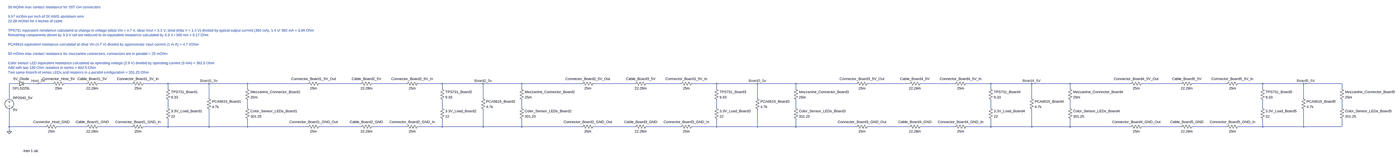
[diagram p0: schematic sensor_system_8_pins.asc, whole sheet]
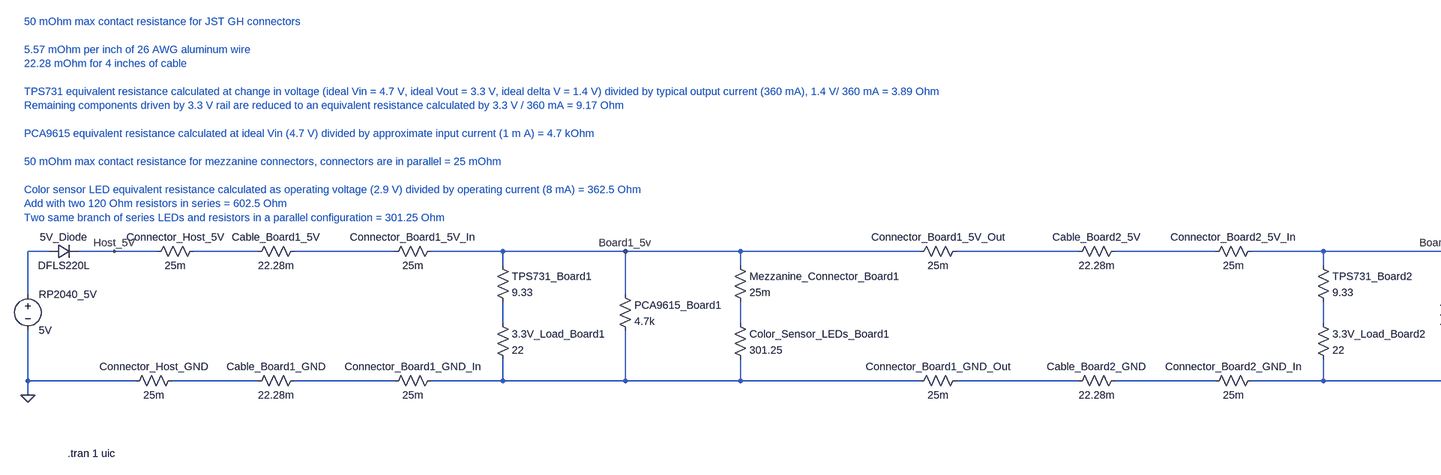
[diagram p1: schematic sensor_system_8_pins.asc, part, row 1 of 1, column 1 of 3]
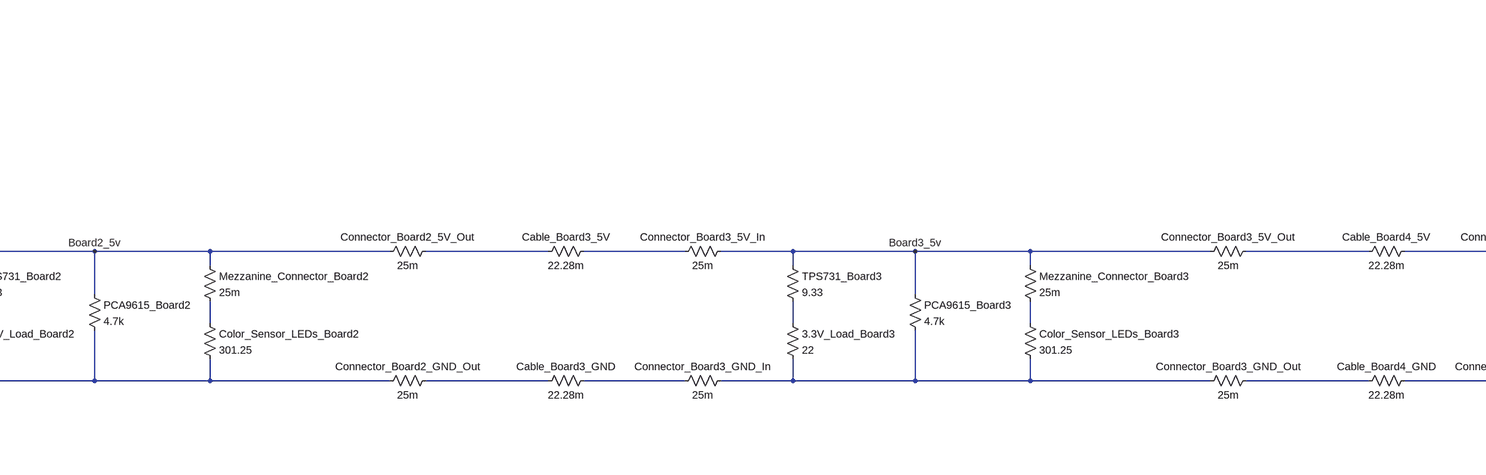
[diagram p2: schematic sensor_system_8_pins.asc, part, row 1 of 1, column 2 of 3]
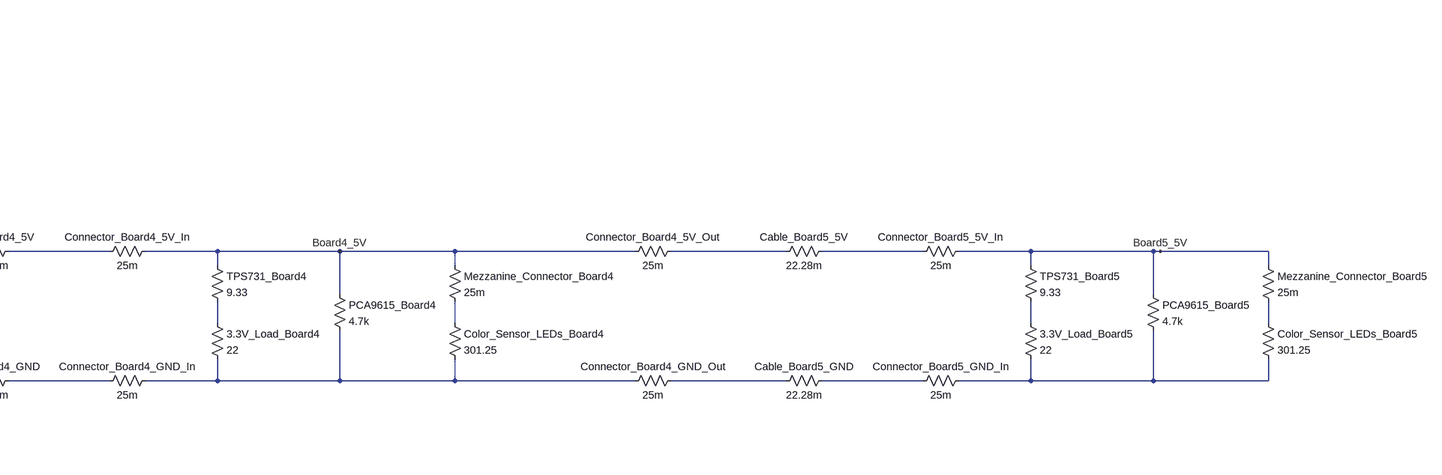
[diagram p3: schematic sensor_system_8_pins.asc, part, row 1 of 1, column 3 of 3]
sensor_system_8_pins.asc, the LTspice schematic file:
Version 4.1
SHEET 1 9256 680
WIRE 64 80 16 80
WIRE 208 80 128 80
WIRE 304 80 208 80
WIRE 528 80 384 80
WIRE 832 80 608 80
WIRE 1072 80 912 80
WIRE 1344 80 1072 80
WIRE 1600 80 1344 80
WIRE 2000 80 1600 80
WIRE 2352 80 2080 80
WIRE 2656 80 2432 80
WIRE 2896 80 2736 80
WIRE 3168 80 2896 80
WIRE 3424 80 3168 80
WIRE 3824 80 3424 80
WIRE 4176 80 3904 80
WIRE 4480 80 4256 80
WIRE 4720 80 4560 80
WIRE 4992 80 4720 80
WIRE 5248 80 4992 80
WIRE 5648 80 5248 80
WIRE 6000 80 5728 80
WIRE 6304 80 6080 80
WIRE 6544 80 6384 80
WIRE 6816 80 6544 80
WIRE 7072 80 6816 80
WIRE 7472 80 7072 80
WIRE 7808 80 7552 80
WIRE 8112 80 7888 80
WIRE 8352 80 8192 80
WIRE 8624 80 8352 80
WIRE 8640 80 8624 80
WIRE 8880 80 8640 80
WIRE 1072 112 1072 80
WIRE 1600 112 1600 80
WIRE 2896 112 2896 80
WIRE 3424 112 3424 80
WIRE 4720 112 4720 80
WIRE 5248 112 5248 80
WIRE 6544 112 6544 80
WIRE 7072 112 7072 80
WIRE 8352 112 8352 80
WIRE 8880 112 8880 80
WIRE 16 176 16 80
WIRE 1344 176 1344 80
WIRE 3168 176 3168 80
WIRE 4992 176 4992 80
WIRE 6816 176 6816 80
WIRE 8624 176 8624 80
WIRE 1072 240 1072 192
WIRE 1600 240 1600 192
WIRE 2896 240 2896 192
WIRE 3424 240 3424 192
WIRE 4720 240 4720 192
WIRE 5248 240 5248 192
WIRE 6544 240 6544 192
WIRE 7072 240 7072 192
WIRE 8352 240 8352 192
WIRE 8880 240 8880 192
WIRE 16 368 16 256
WIRE 256 368 16 368
WIRE 528 368 336 368
WIRE 832 368 608 368
WIRE 1072 368 1072 320
WIRE 1072 368 912 368
WIRE 1344 368 1344 256
WIRE 1344 368 1072 368
WIRE 1600 368 1600 320
WIRE 1600 368 1344 368
WIRE 2000 368 1600 368
WIRE 2352 368 2080 368
WIRE 2656 368 2432 368
WIRE 2896 368 2896 320
WIRE 2896 368 2736 368
WIRE 3168 368 3168 256
WIRE 3168 368 2896 368
WIRE 3424 368 3424 320
WIRE 3424 368 3168 368
WIRE 3824 368 3424 368
WIRE 4176 368 3904 368
WIRE 4480 368 4256 368
WIRE 4720 368 4720 320
WIRE 4720 368 4560 368
WIRE 4992 368 4992 256
WIRE 4992 368 4720 368
WIRE 5248 368 5248 320
WIRE 5248 368 4992 368
WIRE 5648 368 5248 368
WIRE 6000 368 5728 368
WIRE 6304 368 6080 368
WIRE 6544 368 6544 320
WIRE 6544 368 6384 368
WIRE 6816 368 6816 256
WIRE 6816 368 6544 368
WIRE 7072 368 7072 320
WIRE 7072 368 6816 368
WIRE 7472 368 7072 368
WIRE 7808 368 7552 368
WIRE 8112 368 7888 368
WIRE 8352 368 8352 320
WIRE 8352 368 8192 368
WIRE 8624 368 8624 256
WIRE 8624 368 8352 368
WIRE 8880 368 8880 320
WIRE 8880 368 8624 368
WIRE 16 400 16 368
FLAG 16 400 0
FLAG 8640 80 Board5_5V
FLAG 208 80 Host_5V
FLAG 1344 80 Board1_5v
FLAG 3168 80 Board2_5v
FLAG 4992 80 Board3_5v
FLAG 6816 80 Board4_5V
SYMBOL voltage 16 160 R0
SYMATTR InstName RP2040_5V
SYMATTR Value 5V
SYMBOL diode 64 96 R270
WINDOW 0 32 32 VTop 2
WINDOW 3 0 32 VBottom 2
SYMATTR InstName 5V_Diode
SYMATTR Value DFLS220L
SYMBOL res 400 64 R90
WINDOW 0 0 56 VBottom 2
WINDOW 3 32 56 VTop 2
SYMATTR InstName Connector_Host_5V
SYMATTR Value 25m
SYMBOL res 624 64 R90
WINDOW 0 0 56 VBottom 2
WINDOW 3 32 56 VTop 2
SYMATTR InstName Cable_Board1_5V
SYMATTR Value 22.28m
SYMBOL res 928 64 R90
WINDOW 0 0 56 VBottom 2
WINDOW 3 32 56 VTop 2
SYMATTR InstName Connector_Board1_5V_In
SYMATTR Value 25m
SYMBOL res 1056 96 R0
SYMATTR InstName TPS731_Board1
SYMATTR Value 9.33
SYMBOL res 1328 160 R0
SYMATTR InstName PCA9615_Board1
SYMATTR Value 4.7k
SYMBOL res 1584 96 R0
SYMATTR InstName Mezzanine_Connector_Board1
SYMATTR Value 25m
SYMBOL res 2096 64 R90
WINDOW 0 0 56 VBottom 2
WINDOW 3 32 56 VTop 2
SYMATTR InstName Connector_Board1_5V_Out
SYMATTR Value 25m
SYMBOL res 1584 224 R0
SYMATTR InstName Color_Sensor_LEDs_Board1
SYMATTR Value 301.25
SYMBOL res 624 352 R90
WINDOW 0 0 56 VBottom 2
WINDOW 3 32 56 VTop 2
SYMATTR InstName Cable_Board1_GND
SYMATTR Value 22.28m
SYMBOL res 928 352 R90
WINDOW 0 0 56 VBottom 2
WINDOW 3 32 56 VTop 2
SYMATTR InstName Connector_Board1_GND_In
SYMATTR Value 25m
SYMBOL res 2096 352 R90
WINDOW 0 0 56 VBottom 2
WINDOW 3 32 56 VTop 2
SYMATTR InstName Connector_Board1_GND_Out
SYMATTR Value 25m
SYMBOL res 1056 224 R0
SYMATTR InstName 3.3V_Load_Board1
SYMATTR Value 22
SYMBOL res 2448 64 R90
WINDOW 0 0 56 VBottom 2
WINDOW 3 32 56 VTop 2
SYMATTR InstName Cable_Board2_5V
SYMATTR Value 22.28m
SYMBOL res 2752 64 R90
WINDOW 0 0 56 VBottom 2
WINDOW 3 32 56 VTop 2
SYMATTR InstName Connector_Board2_5V_In
SYMATTR Value 25m
SYMBOL res 2880 96 R0
SYMATTR InstName TPS731_Board2
SYMATTR Value 9.33
SYMBOL res 3152 160 R0
SYMATTR InstName PCA9615_Board2
SYMATTR Value 4.7k
SYMBOL res 3408 96 R0
SYMATTR InstName Mezzanine_Connector_Board2
SYMATTR Value 25m
SYMBOL res 3920 64 R90
WINDOW 0 0 56 VBottom 2
WINDOW 3 32 56 VTop 2
SYMATTR InstName Connector_Board2_5V_Out
SYMATTR Value 25m
SYMBOL res 3408 224 R0
SYMATTR InstName Color_Sensor_LEDs_Board2
SYMATTR Value 301.25
SYMBOL res 2448 352 R90
WINDOW 0 0 56 VBottom 2
WINDOW 3 32 56 VTop 2
SYMATTR InstName Cable_Board2_GND
SYMATTR Value 22.28m
SYMBOL res 2752 352 R90
WINDOW 0 0 56 VBottom 2
WINDOW 3 32 56 VTop 2
SYMATTR InstName Connector_Board2_GND_In
SYMATTR Value 25m
SYMBOL res 3920 352 R90
WINDOW 0 0 56 VBottom 2
WINDOW 3 32 56 VTop 2
SYMATTR InstName Connector_Board2_GND_Out
SYMATTR Value 25m
SYMBOL res 2880 224 R0
SYMATTR InstName 3.3V_Load_Board2
SYMATTR Value 22
SYMBOL res 4272 64 R90
WINDOW 0 0 56 VBottom 2
WINDOW 3 32 56 VTop 2
SYMATTR InstName Cable_Board3_5V
SYMATTR Value 22.28m
SYMBOL res 4576 64 R90
WINDOW 0 0 56 VBottom 2
WINDOW 3 32 56 VTop 2
SYMATTR InstName Connector_Board3_5V_In
SYMATTR Value 25m
SYMBOL res 4704 96 R0
SYMATTR InstName TPS731_Board3
SYMATTR Value 9.33
SYMBOL res 4976 160 R0
SYMATTR InstName PCA9615_Board3
SYMATTR Value 4.7k
SYMBOL res 5232 96 R0
SYMATTR InstName Mezzanine_Connector_Board3
SYMATTR Value 25m
SYMBOL res 5744 64 R90
WINDOW 0 0 56 VBottom 2
WINDOW 3 32 56 VTop 2
SYMATTR InstName Connector_Board3_5V_Out
SYMATTR Value 25m
SYMBOL res 5232 224 R0
SYMATTR InstName Color_Sensor_LEDs_Board3
SYMATTR Value 301.25
SYMBOL res 4272 352 R90
WINDOW 0 0 56 VBottom 2
WINDOW 3 32 56 VTop 2
SYMATTR InstName Cable_Board3_GND
SYMATTR Value 22.28m
SYMBOL res 4576 352 R90
WINDOW 0 0 56 VBottom 2
WINDOW 3 32 56 VTop 2
SYMATTR InstName Connector_Board3_GND_In
SYMATTR Value 25m
SYMBOL res 5744 352 R90
WINDOW 0 0 56 VBottom 2
WINDOW 3 32 56 VTop 2
SYMATTR InstName Connector_Board3_GND_Out
SYMATTR Value 25m
SYMBOL res 4704 224 R0
SYMATTR InstName 3.3V_Load_Board3
SYMATTR Value 22
SYMBOL res 6096 64 R90
WINDOW 0 0 56 VBottom 2
WINDOW 3 32 56 VTop 2
SYMATTR InstName Cable_Board4_5V
SYMATTR Value 22.28m
SYMBOL res 6400 64 R90
WINDOW 0 0 56 VBottom 2
WINDOW 3 32 56 VTop 2
SYMATTR InstName Connector_Board4_5V_In
SYMATTR Value 25m
SYMBOL res 6528 96 R0
SYMATTR InstName TPS731_Board4
SYMATTR Value 9.33
SYMBOL res 6800 160 R0
SYMATTR InstName PCA9615_Board4
SYMATTR Value 4.7k
SYMBOL res 7056 96 R0
SYMATTR InstName Mezzanine_Connector_Board4
SYMATTR Value 25m
SYMBOL res 7568 64 R90
WINDOW 0 0 56 VBottom 2
WINDOW 3 32 56 VTop 2
SYMATTR InstName Connector_Board4_5V_Out
SYMATTR Value 25m
SYMBOL res 7056 224 R0
SYMATTR InstName Color_Sensor_LEDs_Board4
SYMATTR Value 301.25
SYMBOL res 6096 352 R90
WINDOW 0 0 56 VBottom 2
WINDOW 3 32 56 VTop 2
SYMATTR InstName Cable_Board4_GND
SYMATTR Value 22.28m
SYMBOL res 6400 352 R90
WINDOW 0 0 56 VBottom 2
WINDOW 3 32 56 VTop 2
SYMATTR InstName Connector_Board4_GND_In
SYMATTR Value 25m
SYMBOL res 7568 352 R90
WINDOW 0 0 56 VBottom 2
WINDOW 3 32 56 VTop 2
SYMATTR InstName Connector_Board4_GND_Out
SYMATTR Value 25m
SYMBOL res 6528 224 R0
SYMATTR InstName 3.3V_Load_Board4
SYMATTR Value 22
SYMBOL res 7904 64 R90
WINDOW 0 0 56 VBottom 2
WINDOW 3 32 56 VTop 2
SYMATTR InstName Cable_Board5_5V
SYMATTR Value 22.28m
SYMBOL res 8208 64 R90
WINDOW 0 0 56 VBottom 2
WINDOW 3 32 56 VTop 2
SYMATTR InstName Connector_Board5_5V_In
SYMATTR Value 25m
SYMBOL res 8336 96 R0
SYMATTR InstName TPS731_Board5
SYMATTR Value 9.33
SYMBOL res 8608 160 R0
SYMATTR InstName PCA9615_Board5
SYMATTR Value 4.7k
SYMBOL res 8864 96 R0
SYMATTR InstName Mezzanine_Connector_Board5
SYMATTR Value 25m
SYMBOL res 8864 224 R0
SYMATTR InstName Color_Sensor_LEDs_Board5
SYMATTR Value 301.25
SYMBOL res 7904 352 R90
WINDOW 0 0 56 VBottom 2
WINDOW 3 32 56 VTop 2
SYMATTR InstName Cable_Board5_GND
SYMATTR Value 22.28m
SYMBOL res 8208 352 R90
WINDOW 0 0 56 VBottom 2
WINDOW 3 32 56 VTop 2
SYMATTR InstName Connector_Board5_GND_In
SYMATTR Value 25m
SYMBOL res 8336 224 R0
SYMATTR InstName 3.3V_Load_Board5
SYMATTR Value 22
SYMBOL res 352 352 R90
WINDOW 0 0 56 VBottom 2
WINDOW 3 32 56 VTop 2
SYMATTR InstName Connector_Host_GND
SYMATTR Value 25m
TEXT 8 -432 Left 2 ;50 mOhm max contact resistance for JST GH connectors\n \n5.57 mOhm per inch of 26 AWG aluminum wire\n22.28 mOhm for 4 inches of cable\n \nTPS731 equivalent resistance calculated at change in voltage (ideal Vin = 4.7 V, ideal Vout = 3.3 V, ideal delta V = 1.4 V) divided by typical output current (360 mA), 1.4 V/ 360 mA = 3.89 Ohm\nRemaining components driven by 3.3 V rail are reduced to an equivalent resistance calculated by 3.3 V / 360 mA = 9.17 Ohm\n \nPCA9615 equivalent resistance calculated at ideal Vin (4.7 V) divided by approximate input current (1 m A) = 4.7 kOhm\n \n50 mOhm max contact resistance for mezzanine connectors, connectors are in parallel = 25 mOhm\n \nColor sensor LED equivalent resistance calculated as operating voltage (2.9 V) divided by operating current (8 mA) = 362.5 Ohm\nAdd with two 120 Ohm resistors in series = 602.5 Ohm\nTwo same branch of series LEDs and resistors in a parallel configuration = 301.25 Ohm
TEXT 104 552 Left 2 !.tran 1 uic

The netlist it stands for:
* sensor_system_8_pins.asc
V§RP2040_5V N001 0 5V
D§5V_Diode N001 Host_5V DFLS220L
R§Connector_Host_5V N002 Host_5V 25m
R§Cable_Board1_5V N003 N002 22.28m
R§Connector_Board1_5V_In Board1_5v N003 25m
R§TPS731_Board1 Board1_5v N012 9.33
R§PCA9615_Board1 Board1_5v N024 4.7k
R§Mezzanine_Connector_Board1 Board1_5v N013 25m
R§Connector_Board1_5V_Out N004 Board1_5v 25m
R§Color_Sensor_LEDs_Board1 N013 N024 301.25
R§Cable_Board1_GND N023 N022 22.28m
R§Connector_Board1_GND_In N024 N023 25m
R§Connector_Board1_GND_Out N025 N024 25m
R§3.3V_Load_Board1 N012 N024 22
R§Cable_Board2_5V N005 N004 22.28m
R§Connector_Board2_5V_In Board2_5v N005 25m
R§TPS731_Board2 Board2_5v N014 9.33
R§PCA9615_Board2 Board2_5v N027 4.7k
R§Mezzanine_Connector_Board2 Board2_5v N015 25m
R§Connector_Board2_5V_Out N006 Board2_5v 25m
R§Color_Sensor_LEDs_Board2 N015 N027 301.25
R§Cable_Board2_GND N026 N025 22.28m
R§Connector_Board2_GND_In N027 N026 25m
R§Connector_Board2_GND_Out N028 N027 25m
R§3.3V_Load_Board2 N014 N027 22
R§Cable_Board3_5V N007 N006 22.28m
R§Connector_Board3_5V_In Board3_5v N007 25m
R§TPS731_Board3 Board3_5v N016 9.33
R§PCA9615_Board3 Board3_5v N030 4.7k
R§Mezzanine_Connector_Board3 Board3_5v N017 25m
R§Connector_Board3_5V_Out N008 Board3_5v 25m
R§Color_Sensor_LEDs_Board3 N017 N030 301.25
R§Cable_Board3_GND N029 N028 22.28m
R§Connector_Board3_GND_In N030 N029 25m
R§Connector_Board3_GND_Out N031 N030 25m
R§3.3V_Load_Board3 N016 N030 22
R§Cable_Board4_5V N009 N008 22.28m
R§Connector_Board4_5V_In Board4_5V N009 25m
R§TPS731_Board4 Board4_5V N018 9.33
R§PCA9615_Board4 Board4_5V N033 4.7k
R§Mezzanine_Connector_Board4 Board4_5V N019 25m
R§Connector_Board4_5V_Out N010 Board4_5V 25m
R§Color_Sensor_LEDs_Board4 N019 N033 301.25
R§Cable_Board4_GND N032 N031 22.28m
R§Connector_Board4_GND_In N033 N032 25m
R§Connector_Board4_GND_Out N034 N033 25m
R§3.3V_Load_Board4 N018 N033 22
R§Cable_Board5_5V N011 N010 22.28m
R§Connector_Board5_5V_In Board5_5V N011 25m
R§TPS731_Board5 Board5_5V N020 9.33
R§PCA9615_Board5 Board5_5V N036 4.7k
R§Mezzanine_Connector_Board5 Board5_5V N021 25m
R§Color_Sensor_LEDs_Board5 N021 N036 301.25
R§Cable_Board5_GND N035 N034 22.28m
R§Connector_Board5_GND_In N036 N035 25m
R§3.3V_Load_Board5 N020 N036 22
R§Connector_Host_GND N022 0 25m
.model D D
.lib standard.dio
* 50 mOhm max contact resistance for JST GH connectors
* 5.57 mOhm per inch of 26 AWG aluminum wire
* 22.28 mOhm for 4 inches of cable
* TPS731 equivalent resistance calculated at change in voltage (ideal Vin = 4.7 V, ideal Vout = 3.3 V, ideal delta V = 1.4 V) divided by typical output current (360 mA), 1.4 V/ 360 mA = 3.89 Ohm
* Remaining components driven by 3.3 V rail are reduced to an equivalent resistance calculated by 3.3 V / 360 mA = 9.17 Ohm
* PCA9615 equivalent resistance calculated at ideal Vin (4.7 V) divided by approximate input current (1 m A) = 4.7 kOhm
* 50 mOhm max contact resistance for mezzanine connectors, connectors are in parallel = 25 mOhm
* Color sensor LED equivalent resistance calculated as operating voltage (2.9 V) divided by operating current (8 mA) = 362.5 Ohm
* Add with two 120 Ohm resistors in series = 602.5 Ohm
* Two same branch of series LEDs and resistors in a parallel configuration = 301.25 Ohm
.tran 1 uic
.backanno
.end